# Altium schematic sheet FPGA_2_MICS_SUP.SchDoc: FMC DAC 1.5GS 4CH
size 420 x 297 mm; Author: G.Kasprowicz; CompanyName: WUT ISE; DrawnBy: G.Kasprowicz; Organization: WUT ISE; Address1: PW ISE; Address2: Nowowiejska 15/19 00-665 Warsaw; Address3: gkasprow@gmail.com; Revision: 1; SheetNumber: 23; SheetTotal: 25; ModifiedBy: -; CheckedDate: -; Title2: FMC; DivGrp: WUT ISE; Designer: G.Kasprowicz; ModifiedDate: -; ProjectName: Sensor Box
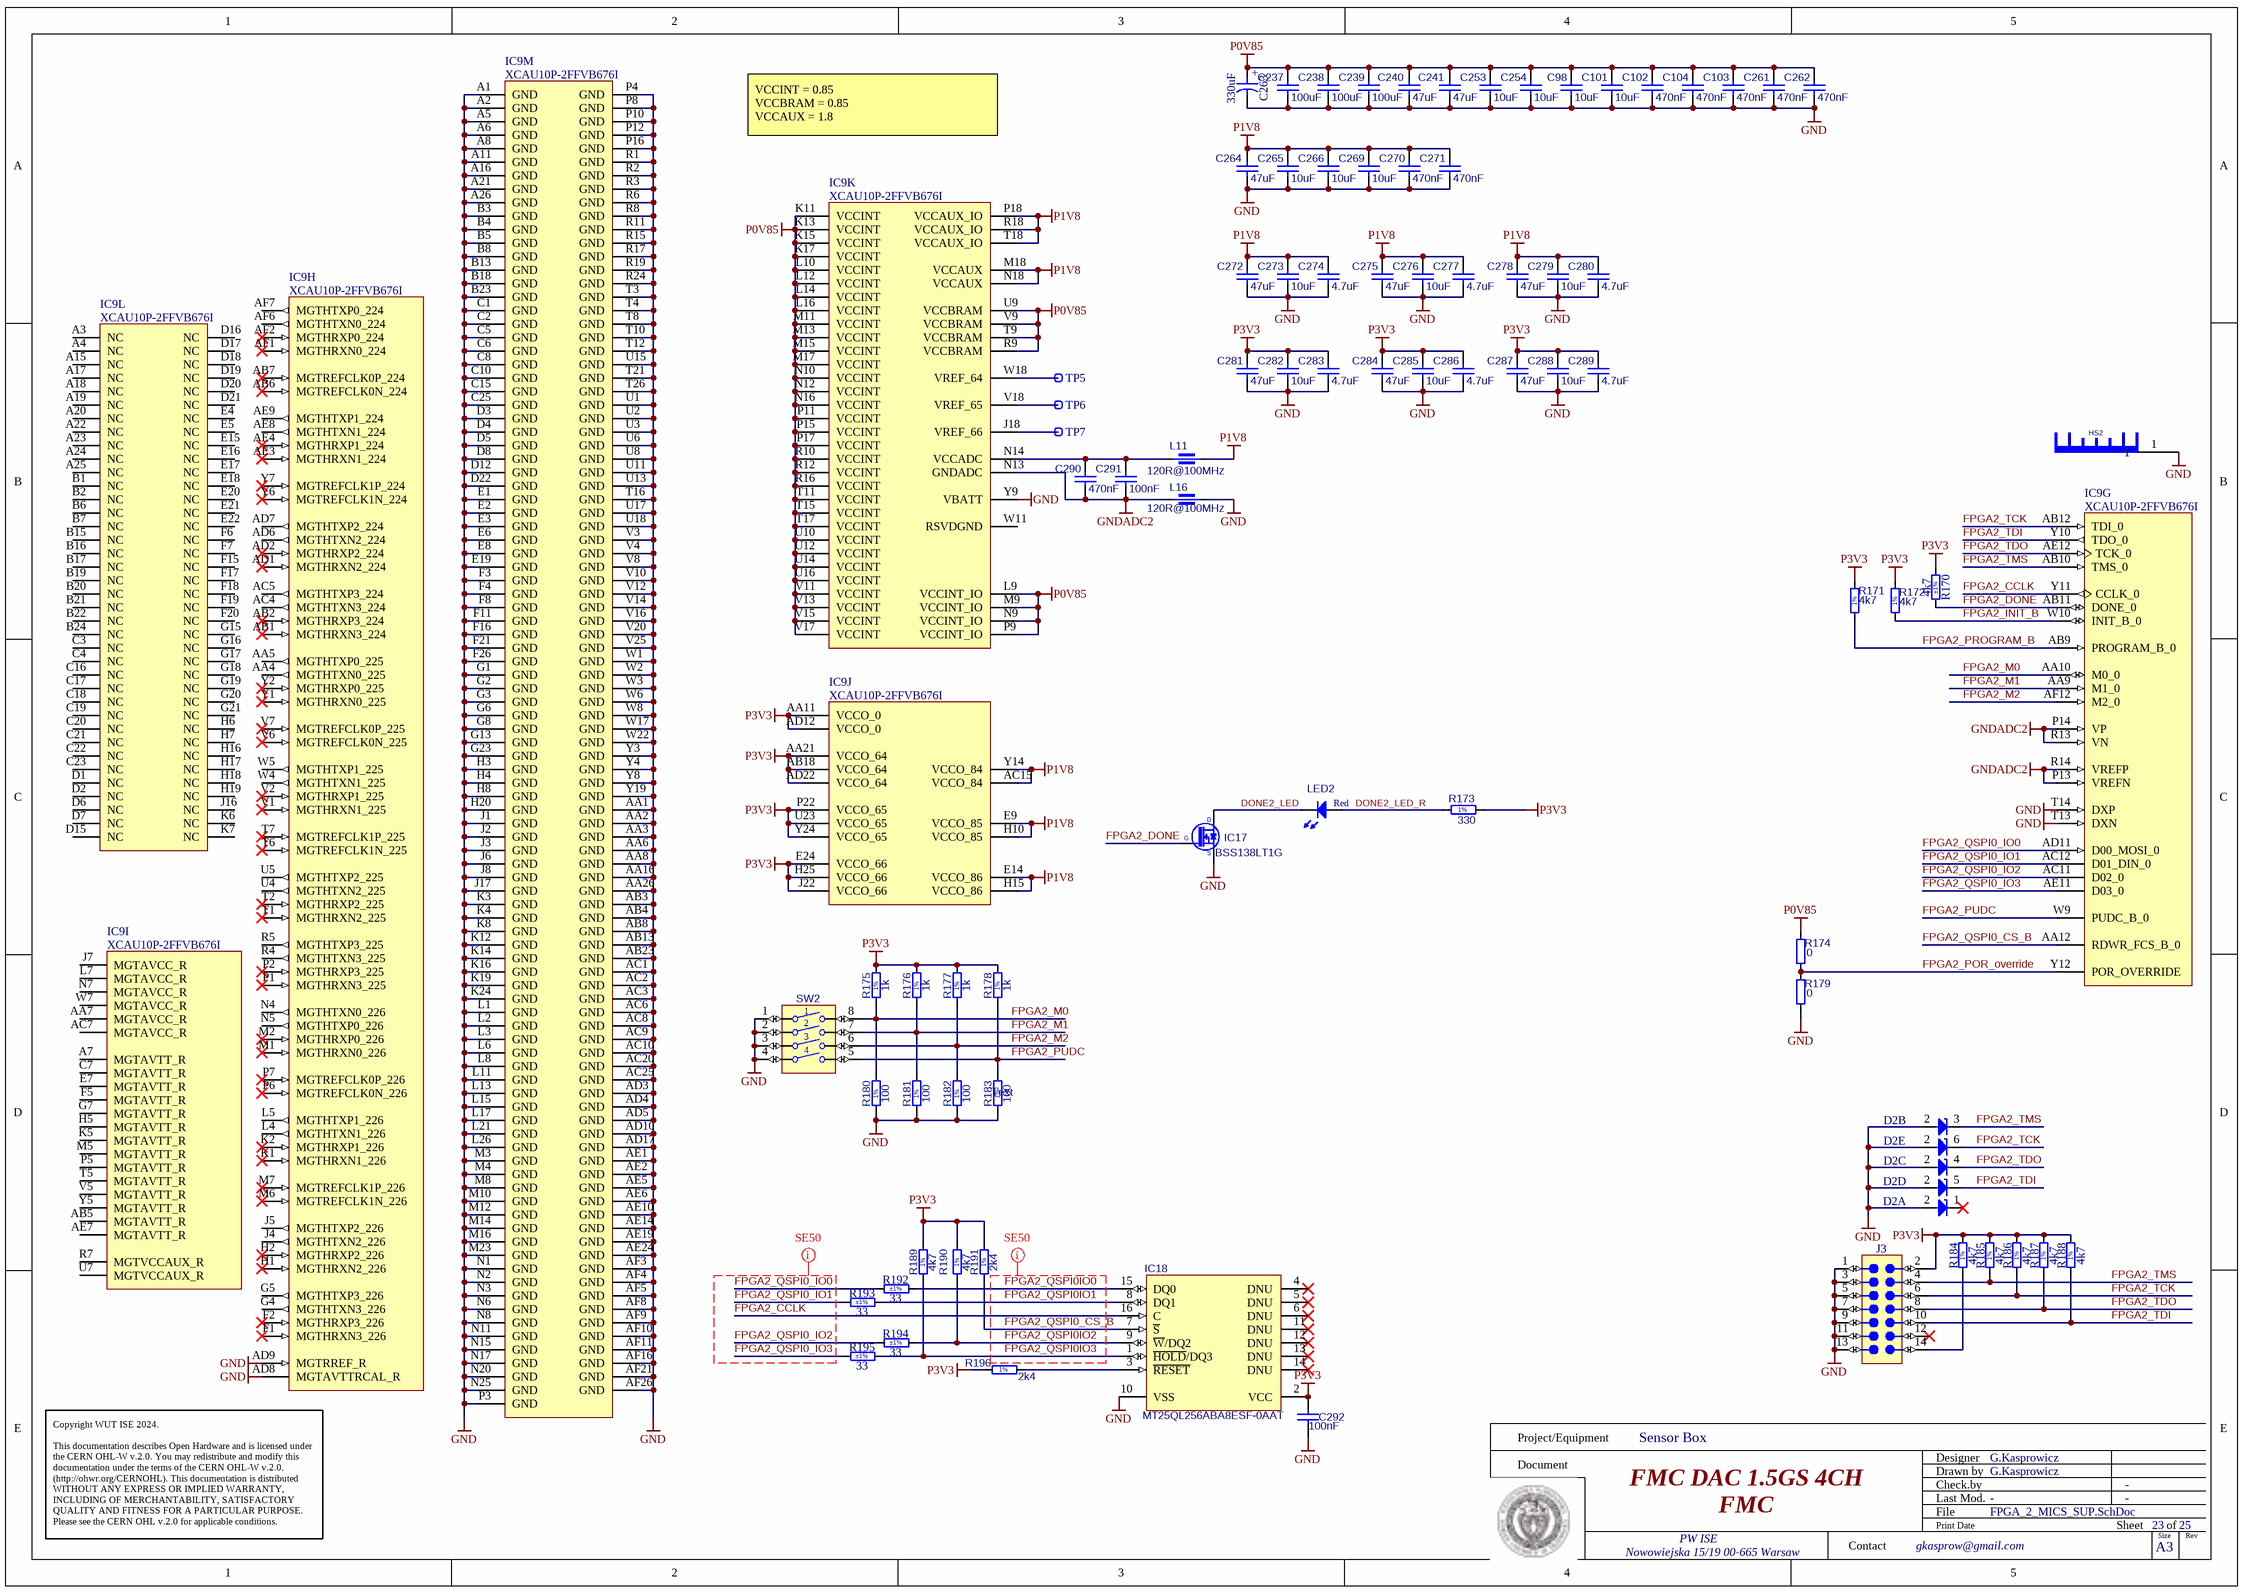
[diagram p0: FPGA_2_MICS_SUP.SchDoc]

## Parts
C98  10uF  [CAPC1005X70N]
C101  10uF  [CAPC1005X70N]
C102  470nF  [CAPC0603X33N]
C103  470nF  [CAPC0603X33N]
C104  470nF  [CAPC0603X33N]
C237  100uF  [CAPC2013X145N]
C238  100uF  [CAPC2013X145N]
C239  100uF  [CAPC2013X145N]
C240  47uF  [CAPC1608X100N]
C241  47uF  [CAPC1608X100N]
C253  10uF  [CAPC1005X70N]
C254  10uF  [CAPC1005X70N]
C261  470nF  [CAPC0603X33N]
C262  470nF  [CAPC0603X33N]
C263  330uF  [CAPMP7343X190N]
C264  47uF  [CAPC1608X100N]
C265  10uF  [CAPC1005X70N]
C266  10uF  [CAPC1005X70N]
C269  10uF  [CAPC1005X70N]
C270  470nF  [CAPC0603X33N]
C271  470nF  [CAPC0603X33N]
C272  47uF  [CAPC1608X100N]
C273  10uF  [CAPC1005X70N]
C274  4.7uF  [CAPC1005X61N]
C275  47uF  [CAPC1608X100N]
C276  10uF  [CAPC1005X70N]
C277  4.7uF  [CAPC1005X61N]
C278  47uF  [CAPC1608X100N]
C279  10uF  [CAPC1005X70N]
C280  4.7uF  [CAPC1005X61N]
C281  47uF  [CAPC1608X100N]
C282  10uF  [CAPC1005X70N]
C283  4.7uF  [CAPC1005X61N]
C284  47uF  [CAPC1608X100N]
C285  10uF  [CAPC1005X70N]
C286  4.7uF  [CAPC1005X61N]
C287  47uF  [CAPC1608X100N]
C288  10uF  [CAPC1005X70N]
C289  4.7uF  [CAPC1005X61N]
C290  470nF  [CAPC1005X55N]
C291  100nF  [CAPC0603X33N]
C292  100nF  [CAPC0603X33N]
D2  PESD3V3L5UY  [SOT65P210X110-6N]  (value not drawn)  (parts A,B,C,D,E of 5)
HS2  Heat Sink No Pad  [HSINK_WAKEFIELD_SKV585811-CU]  (value not drawn)
IC9  XCAU10P-2FFVB676I  [BGA676C100P26X26_2700X2700X350]  (parts G,H,I,J,K,L,M of 13)
IC17  BSS138LT1G  [SOT95P240X110-3N]
IC18  MT25QL256ABA8ESF-0AAT  [SOIC127P1030X265-16N]
J3  (no value)  [MOLEX_87832-1420]
L11  120R@100MHz  [INDC1608X95N]
L16  120R@100MHz  [INDC1608X95N]
LED2  Red  [LED_KINGBRIGHT_KPH-1608SURCK]
R170  4k7  Tolerance: ±1%  [RESC1005X40N]
R171  4k7  [RESC1005X40N]
R172  4k7  [RESC1005X40N]
R173  330  [RESC1005X40N]
R174  0  [RESC1005X40N]
R175  1k  [RESC1005X40N]
R176  1k  [RESC1005X40N]
R177  1k  [RESC1005X40N]
R178  1k  [RESC1005X40N]
R179  0  [RESC1005X40N]
R180  100  [RESC1005X40N]
R181  100  [RESC1005X40N]
R182  100  [RESC1005X40N]
R183  100  [RESC1005X40N]
R184  4k7  [RESC1005X40N]
R185  4k7  [RESC1005X40N]
R186  4k7  [RESC1005X40N]
R187  4k7  [RESC1005X40N]
R188  4k7  [RESC1005X40N]
R189  4k7  [RESC1005X40N]
R190  4k7  [RESC1005X40N]
R191  2k4  [RESC1005X40N]
R192  33  Tolerance: ±1%  [RESC1005X40N]
R193  33  Tolerance: ±1%  [RESC1005X40N]
R194  33  Tolerance: ±1%  [RESC1005X40N]
R195  33  Tolerance: ±1%  [RESC1005X40N]
R196  2k4  [RESC1005X40N]
SW2  Switch  [SW_TYCO_1571983-4]  (value not drawn)
TP5  Test Point  [TPS127]  (value not drawn)
TP6  Test Point  [TPS127]  (value not drawn)
TP7  Test Point  [TPS127]  (value not drawn)

## Nets
GND: C98.1 C101.1 C102.1 C103.1 C104.1 C237.1 C238.1 C239.1 C240.1 C241.1 C253.1 C254.1 C261.1 C262.1 C263.2 C264.1 C265.1 C266.1 C269.1 C270.1 C271.1 C272.1 C273.1 C274.1 C275.1 C276.1 C277.1 C278.1 C279.1 C280.1 C281.1 C282.1 C283.1 C284.1 C285.1 C286.1 C287.1 C288.1 C289.1 C292.1 D2.2(A) HS2.1 IC9.A1(GND) IC9.A2(GND) IC9.A5(GND) IC9.A6(GND) IC9.A8(GND) IC9.A11(GND) IC9.A16(GND) IC9.A21(GND) IC9.A26(GND) IC9.AA1(GND) IC9.AA2(GND) IC9.AA3(GND) IC9.AA6(GND) IC9.AA8(GND) IC9.AA16(GND) IC9.AA26(GND) IC9.AB3(GND) IC9.AB4(GND) IC9.AB8(GND) IC9.AB13(GND) IC9.AB23(GND) IC9.AC1(GND) IC9.AC2(GND) IC9.AC3(GND) IC9.AC6(GND) IC9.AC8(GND) IC9.AC9(GND) IC9.AC10(GND) IC9.AC20(GND) IC9.AC25(GND) IC9.AD3(GND) IC9.AD4(GND) IC9.AD5(GND) IC9.AD8(MGTAVTTRCAL_R) IC9.AD9(MGTRREF_R) IC9.AD10(GND) IC9.AD17(GND) IC9.AE1(GND) IC9.AE2(GND) IC9.AE5(GND) IC9.AE6(GND) IC9.AE10(GND) IC9.AE14(GND) IC9.AE19(GND) IC9.AE24(GND) IC9.AF3(GND) IC9.AF4(GND) IC9.AF5(GND) IC9.AF8(GND) IC9.AF9(GND) IC9.AF10(GND) IC9.AF11(GND) IC9.AF16(GND) IC9.AF21(GND) IC9.AF26(GND) IC9.B3(GND) IC9.B4(GND) IC9.B5(GND) IC9.B8(GND) IC9.B13(GND) IC9.B18(GND) IC9.B23(GND) IC9.C1(GND) IC9.C2(GND) IC9.C5(GND) IC9.C6(GND) IC9.C8(GND) IC9.C10(GND) IC9.C15(GND) IC9.C25(GND) IC9.D3(GND) IC9.D4(GND) IC9.D5(GND) IC9.D8(GND) IC9.D12(GND) IC9.D22(GND) IC9.E1(GND) IC9.E2(GND) IC9.E3(GND) IC9.E6(GND) IC9.E8(GND) IC9.E19(GND) IC9.F3(GND) IC9.F4(GND) IC9.F8(GND) IC9.F11(GND) IC9.F16(GND) IC9.F21(GND) IC9.F26(GND) IC9.G1(GND) IC9.G2(GND) IC9.G3(GND) IC9.G6(GND) IC9.G8(GND) IC9.G13(GND) IC9.G23(GND) IC9.H3(GND) IC9.H4(GND) IC9.H8(GND) IC9.H20(GND) IC9.J1(GND) IC9.J2(GND) IC9.J3(GND) IC9.J6(GND) IC9.J8(GND) IC9.J17(GND) IC9.K3(GND) IC9.K4(GND) IC9.K8(GND) IC9.K12(GND) IC9.K14(GND) IC9.K16(GND) IC9.K19(GND) IC9.K24(GND) IC9.L1(GND) IC9.L2(GND) IC9.L3(GND) IC9.L6(GND) IC9.L8(GND) IC9.L11(GND) IC9.L13(GND) IC9.L15(GND) IC9.L17(GND) IC9.L21(GND) IC9.L26(GND) IC9.M3(GND) IC9.M4(GND) IC9.M8(GND) IC9.M10(GND) IC9.M12(GND) IC9.M14(GND) IC9.M16(GND) IC9.M23(GND) IC9.N1(GND) IC9.N2(GND) IC9.N3(GND) IC9.N6(GND) IC9.N8(GND) IC9.N11(GND) IC9.N15(GND) IC9.N17(GND) IC9.N20(GND) IC9.N25(GND) IC9.P3(GND) IC9.P4(GND) IC9.P8(GND) IC9.P10(GND) IC9.P12(GND) IC9.P16(GND) IC9.R1(GND) IC9.R2(GND) IC9.R3(GND) IC9.R6(GND) IC9.R8(GND) IC9.R11(GND) IC9.R15(GND) IC9.R17(GND) IC9.R19(GND) IC9.R24(GND) IC9.T3(GND) IC9.T4(GND) IC9.T8(GND) IC9.T10(GND) IC9.T12(GND) IC9.T13(DXN) IC9.T14(DXP) IC9.T16(GND) IC9.T21(GND) IC9.T26(GND) IC9.U1(GND) IC9.U2(GND) IC9.U3(GND) IC9.U6(GND) IC9.U8(GND) IC9.U11(GND) IC9.U13(GND) IC9.U15(GND) IC9.U17(GND) IC9.U18(GND) IC9.V3(GND) IC9.V4(GND) IC9.V8(GND) IC9.V10(GND) IC9.V12(GND) IC9.V14(GND) IC9.V16(GND) IC9.V20(GND) IC9.V25(GND) IC9.W1(GND) IC9.W2(GND) IC9.W3(GND) IC9.W6(GND) IC9.W8(GND) IC9.W17(GND) IC9.W22(GND) IC9.Y3(GND) IC9.Y4(GND) IC9.Y8(GND) IC9.Y9(VBATT) IC9.Y19(GND) IC17.2(S) IC18.10(VSS) J3.1 J3.3 J3.5 J3.7 J3.9 J3.11 J3.13 L16.2 R179.1 R180.1 R181.1 R182.1 R183.1 SW2.1 SW2.2 SW2.3 SW2.4
GNDADC2: C290.1 C291.1 IC9.N13(GNDADC) IC9.P13(VREFN) IC9.P14(VP) IC9.R13(VN) IC9.R14(VREFP) L16.1
P0V85: C98.2 C101.2 C102.2 C103.2 C104.2 C237.2 C238.2 C239.2 C240.2 C241.2 C253.2 C254.2 C261.2 C262.2 C263.1 IC9.K11(VCCINT) IC9.K13(VCCINT) IC9.K15(VCCINT) IC9.K17(VCCINT) IC9.L9(VCCINT_IO) IC9.L10(VCCINT) IC9.L12(VCCINT) IC9.L14(VCCINT) IC9.L16(VCCINT) IC9.M9(VCCINT_IO) IC9.M11(VCCINT) IC9.M13(VCCINT) IC9.M15(VCCINT) IC9.M17(VCCINT) IC9.N9(VCCINT_IO) IC9.N10(VCCINT) IC9.N12(VCCINT) IC9.N16(VCCINT) IC9.P9(VCCINT_IO) IC9.P11(VCCINT) IC9.P15(VCCINT) IC9.P17(VCCINT) IC9.R9(VCCBRAM) IC9.R10(VCCINT) IC9.R12(VCCINT) IC9.R16(VCCINT) IC9.T9(VCCBRAM) IC9.T11(VCCINT) IC9.T15(VCCINT) IC9.T17(VCCINT) IC9.U9(VCCBRAM) IC9.U10(VCCINT) IC9.U12(VCCINT) IC9.U14(VCCINT) IC9.U16(VCCINT) IC9.V9(VCCBRAM) IC9.V11(VCCINT) IC9.V13(VCCINT) IC9.V15(VCCINT) IC9.V17(VCCINT) R174.2
P1V8: C264.2 C265.2 C266.2 C269.2 C270.2 C271.2 C272.2 C273.2 C274.2 C275.2 C276.2 C277.2 C278.2 C279.2 C280.2 IC9.AC15(VCCO_84) IC9.E9(VCCO_85) IC9.E14(VCCO_86) IC9.H10(VCCO_85) IC9.H15(VCCO_86) IC9.M18(VCCAUX) IC9.N18(VCCAUX) IC9.P18(VCCAUX_IO) IC9.R18(VCCAUX_IO) IC9.T18(VCCAUX_IO) IC9.Y14(VCCO_84) L11.2
P3V3: C281.2 C282.2 C283.2 C284.2 C285.2 C286.2 C287.2 C288.2 C289.2 C292.2 IC9.AA11(VCCO_0) IC9.AA21(VCCO_64) IC9.AB18(VCCO_64) IC9.AD12(VCCO_0) IC9.AD22(VCCO_64) IC9.E24(VCCO_66) IC9.H25(VCCO_66) IC9.J22(VCCO_66) IC9.P22(VCCO_65) IC9.U23(VCCO_65) IC9.Y24(VCCO_65) IC18.2(VCC) J3.2 R170.2 R171.2 R172.2 R173.2 R175.2 R176.2 R177.2 R178.2 R184.2 R185.2 R186.2 R187.2 R188.2 R189.2 R190.2 R191.2 R196.1
DONE2_LED: IC17.3(D) LED2.1(C)
DONE2_LED_R: LED2.2(A) R173.1
FPGA2_CCLK: IC9.Y11(CCLK_0) IC18.16(C)
FPGA2_DONE: IC9.AB11(DONE_0) IC17.1(G) R170.1
FPGA2_INIT_B: IC9.W10(INIT_B_0) R172.1
FPGA2_M0: IC9.AA10(M0_0) R175.1 R180.2 SW2.8
FPGA2_M1: IC9.AA9(M1_0) R176.1 R181.2 SW2.7
FPGA2_M2: IC9.AF12(M2_0) R177.1 R182.2 SW2.6
FPGA2_POR_override: IC9.Y12(POR_OVERRIDE) R174.1 R179.2
FPGA2_PROGRAM_B: IC9.AB9(PROGRAM_B_0) R171.1
FPGA2_PUDC: IC9.W9(PUDC_B_0) R178.1 R183.2 SW2.5
FPGA2_QSPI0_CS_B: IC9.AA12(RDWR_FCS_B_0) IC18.7(~{S}) R191.1
FPGA2_QSPI0_IO0: IC9.AD11(D00_MOSI_0) R192.1
FPGA2_QSPI0_IO1: IC9.AC12(D01_DIN_0) R193.1
FPGA2_QSPI0_IO2: IC9.AC11(D02_0) R194.1
FPGA2_QSPI0_IO3: IC9.AE11(D03_0) R195.1
FPGA2_QSPI0IO0: IC18.15(DQ0) R192.2
FPGA2_QSPI0IO1: IC18.8(DQ1) R193.2
FPGA2_QSPI0IO2: IC18.9(~{W}/DQ2) R190.1 R194.2
FPGA2_QSPI0IO3: IC18.1(~{HOLD}/DQ3) R189.1 R195.2
FPGA2_TCK: D2.6(C) IC9.AB12(TDI_0) J3.6 R186.1
FPGA2_TDI: D2.5(C) IC9.Y10(TDO_0) J3.10 R188.1
FPGA2_TDO: D2.4(C) IC9.AE12(TCK_0) J3.8 R187.1
FPGA2_TMS: D2.3(C) IC9.AB10(TMS_0) J3.4 R185.1
NetC290_2: C290.2 C291.2 IC9.N14(VCCADC) L11.1
NetIC9_J18: IC9.J18(VREF_66) TP7.1
NetIC9_V18: IC9.V18(VREF_65) TP6.1
NetIC9_W18: IC9.W18(VREF_64) TP5.1
NetIC18_3: IC18.3(~{RESET}) R196.2
NetJ3_14: J3.14 R184.1

Not connected (* = marked no-connect by the designer): D2 1(C)*; IC9 A3(NC) A4(NC) A7(MGTAVTT_R) A15(NC) A17(NC) A18(NC) A19(NC) A20(NC) A22(NC) A23(NC) A24(NC) A25(NC) AA4(MGTHTXN0_225) AA5(MGTHTXP0_225) AA7(MGTAVCC_R) AB1(MGTHRXN3_224)* AB2(MGTHRXP3_224)* AB5(MGTAVTT_R) AB6(MGTREFCLK0N_224)* AB7(MGTREFCLK0P_224)* AC4(MGTHTXN3_224) AC5(MGTHTXP3_224) AC7(MGTAVCC_R) AD1(MGTHRXN2_224)* AD2(MGTHRXP2_224)* AD6(MGTHTXN2_224) AD7(MGTHTXP2_224) AE3(MGTHRXN1_224)* AE4(MGTHRXP1_224)* AE7(MGTAVTT_R) AE8(MGTHTXN1_224) AE9(MGTHTXP1_224) AF1(MGTHRXN0_224)* AF2(MGTHRXP0_224)* AF6(MGTHTXN0_224) AF7(MGTHTXP0_224) B1(NC) B2(NC) B6(NC) B7(NC) B15(NC) B16(NC) B17(NC) B19(NC) B20(NC) B21(NC) B22(NC) B24(NC) C3(NC) C4(NC) C7(MGTAVTT_R) C16(NC) C17(NC) C18(NC) C19(NC) C20(NC) C21(NC) C22(NC) C23(NC) D1(NC) D2(NC) D6(NC) D7(NC) D15(NC) D16(NC) D17(NC) D18(NC) D19(NC) D20(NC) D21(NC) E4(NC) E5(NC) E7(MGTAVTT_R) E15(NC) E16(NC) E17(NC) E18(NC) E20(NC) E21(NC) E22(NC) F1(MGTHRXN3_226)* F2(MGTHRXP3_226)* F5(MGTAVTT_R) F6(NC) F7(NC) F15(NC) F17(NC) F18(NC) F19(NC) F20(NC) G4(MGTHTXN3_226) G5(MGTHTXP3_226) G7(MGTAVTT_R) G15(NC) G16(NC) G17(NC) G18(NC) G19(NC) G20(NC) G21(NC) H1(MGTHRXN2_226)* H2(MGTHRXP2_226)* H5(MGTAVTT_R) H6(NC) H7(NC) H16(NC) H17(NC) H18(NC) H19(NC) J4(MGTHTXN2_226) J5(MGTHTXP2_226) J7(MGTAVCC_R) J16(NC) K1(MGTHRXN1_226)* K2(MGTHRXP1_226)* K5(MGTAVTT_R) K6(NC) K7(NC) L4(MGTHTXN1_226) L5(MGTHTXP1_226) L7(MGTAVCC_R) M1(MGTHRXN0_226)* M2(MGTHRXP0_226)* M5(MGTAVTT_R) M6(MGTREFCLK1N_226)* M7(MGTREFCLK1P_226)* N4(MGTHTXN0_226) N5(MGTHTXP0_226) N7(MGTAVCC_R) P1(MGTHRXN3_225)* P2(MGTHRXP3_225)* P5(MGTAVTT_R) P6(MGTREFCLK0N_226)* P7(MGTREFCLK0P_226)* R4(MGTHTXN3_225) R5(MGTHTXP3_225) R7(MGTVCCAUX_R) T1(MGTHRXN2_225)* T2(MGTHRXP2_225)* T5(MGTAVTT_R) T6(MGTREFCLK1N_225)* T7(MGTREFCLK1P_225)* U4(MGTHTXN2_225) U5(MGTHTXP2_225) U7(MGTVCCAUX_R) V1(MGTHRXN1_225)* V2(MGTHRXP1_225)* V5(MGTAVTT_R) V6(MGTREFCLK0N_225)* V7(MGTREFCLK0P_225)* W4(MGTHTXN1_225) W5(MGTHTXP1_225) W7(MGTAVCC_R) W11(RSVDGND) Y1(MGTHRXN0_225)* Y2(MGTHRXP0_225)* Y5(MGTAVTT_R) Y6(MGTREFCLK1N_224)* Y7(MGTREFCLK1P_224)*; IC18 4(DNU)* 5(DNU)* 6(DNU)* 11(DNU)* 12(DNU)* 13(DNU)* 14(DNU)*; J3 12*

## Layout directives
net class SE50: FPGA2_CCLK, FPGA2_QSPI0_CS_B, FPGA2_QSPI0_IO0, FPGA2_QSPI0_IO1, FPGA2_QSPI0_IO2, FPGA2_QSPI0_IO3, FPGA2_QSPI0IO0, FPGA2_QSPI0IO1, FPGA2_QSPI0IO2, FPGA2_QSPI0IO3

## Notes on the sheet
- VCCINT = 0.85
  VCCBRAM = 0.85
  VCCAUX = 1.8
- (near R183) Text
- Project/Equipment
- Document
- Designer
- Drawn by
- Check.by
- Copyright WUT ISE 2024.
  This documentation describes Open Hardware and is licensed under the CERN OHL-W v.2.0. You may redistribute and modify this documentation under the terms of the CERN OHL-W v.2.0. (http://ohwr.org/CERNOHL). This documentation is distributed WITHOUT ANY EXPRESS OR IMPLIED WARRANTY, INCLUDING OF MERCHANTABILITY, SATISFACTORY QUALITY AND FITNESS FOR A PARTICULAR PURPOSE. Please see the CERN OHL v.2.0 for applicable conditions.
- Contact
- File
- Last Mod.
- Print Date
- Sheet
- Size
- A3
- of
- Rev
- (in symbol CTE7343-19_330UF_2.5V_20%_LESR0009_KEMET_T520) +
- (in symbol R0402_1k_1%_0.0625W_100PPM) 1%
- (in symbol R0402_2K4_1%_0.0625W_100PPM) 1%
- (in symbol R0402_4K7_1%_0.0625W_100PPM) 1%
- (in symbol R0402_4k7_1%_0.0625W_100PPM) 1%
- (in symbol R0402_100R_1%_0.0625W_100PPM) 1%
- (in symbol R0402_330R_1%_0.0625W_100PPM) 1%

## Library data of the parts
C98 C101 C253 C254 C265 C266 C269 C273 C276 C279 C282 C285 C288 = CC0402_10UF_6.3V_20%_X5R: Non-polarised capacitor; Part Description: SMD Multilayer Chip Ceramic Capacitor; Manufacturer: GENERIC; Manufacturer1 Part Number: C1005X5R0J106M050BC; Voltage: 6.3V; TC: X5R; Tolerance: ±10%; Part Number: CC0402_10UF_6.3V_20%_X5R; Component Kind: Standard; Component Type: Standard; Pin Count: 2; Value: 10uF; Status: Preferred; Manufacturer Part Number: CC0402_10UF_6.3V_20%_X5R; Case: 0402; Mounted: Yes; Socket: No; SMD: Yes; Sense: No; Manufacturer1 Example: TDK; Manufacturer1 ComponentHeight: 0.70mm; HelpURL: \\cern.ch\dfs\Applications\Altium\Datasheets\CC0402_X5R_TDK_C.pdf; Author: CERN DEM JLC; CreateDate: 07.01.2015; LatestRevisionDate: 07.01.2015
C102-C104 C261 C262 C270 C271 = CC0201_470NF_4V_20%_X5R: Non-polarised capacitor; Part Description: SMD Multilayer Chip Ceramic Capacitor; Manufacturer: GENERIC; Manufacturer1 Part Number: AMK063BJ474MP-F; Voltage: 4V; TC: X5R; Tolerance: ±20%; Part Number: CC0201_470NF_4V_20%_X5R; Component Kind: Standard; Component Type: Standard; Pin Count: 2; Value: 470nF; Status: Not Recommended; Manufacturer Part Number: CC0201_470NF_4V_20%_X5R; Case: 0201; Mounted: Yes; Socket: No; SMD: Yes; Sense: No; Manufacturer1 Example: TAIYO YUDEN; Manufacturer1 ComponentHeight: 0.33mm; HelpURL: \\cern.ch\dfs\Applications\Altium\Datasheets\CC0201_X5R_TAIYO-YUDEN_STANDARD-CLASS2.pdf; Author: CERN DEM JLC; CreateDate: 27.05.2010; LatestRevisionDate: 27.05.2010
C237-C239 = CC0805_100UF_4V_20%_X6S_MURATA_GRM21BC80G107ME15: Non-polarised capacitor; Part Description: Chip Multilayer Ceramic Capacitor for General Purpose; Manufacturer: MURATA; Voltage: 4V; TC: X6S; Tolerance: ±20%; Part Number: CC0805_100UF_4V_20%_X6S_MURATA_GRM21BC80G107ME15; Component Kind: Standard; Component Type: Standard; Pin Count: 2; Value: 100uF; Status: None; Manufacturer Part Number: GRM21BC80G107ME15; Case: 0805; Mounted: Yes; Socket: No; SMD: Yes; Sense: No; ComponentHeight: 1.45mm; HelpURL: \\cern.ch\dfs\Applications\Altium\Datasheets\CC0805_MURATA_GRM21BC80G107ME15.pdf; Author: CERN DEM BC; CreateDate: 2020-09-02; LatestRevisionDate: 2020-09-02
C240 C241 C264 = CC0603_47UF_2.5V_20%_X6S_MURATA_GRM188C80E476ME05: Non-polarised capacitor; Part Description: Chip Multilayer Ceramic Capacitor for General Purpose; Manufacturer: MURATA; Voltage: 2.5V; TC: X6S; Tolerance: ±20%; Part Number: CC0603_47UF_2.5V_20%_X6S_MURATA_GRM188C80E476ME05; Component Kind: Standard; Component Type: Standard; Pin Count: 2; Value: 47uF; Status: None; Manufacturer Part Number: GRM188C80E476ME05; Case: 0603; Mounted: Yes; Socket: No; SMD: Yes; Sense: No; ComponentHeight: 1mm; HelpURL: \\cern.ch\dfs\Applications\Altium\Datasheets\CC0603_MURATA_GRM188C80E476ME05.pdf; Author: CERN DEM BC; CreateDate: 2020-09-02; LatestRevisionDate: 2020-09-02
C263 = CTE7343-19_330UF_2.5V_20%_LESR0009_KEMET_T520: Polarised capacitor; Part Description: Low ESR 0R009 Tantalum Chip Capacitor; Manufacturer: KEMET; Manufacturer Part Number: T520V337M2R5ATE009; Voltage: 2.5V; Tolerance: ±20%; Part Number: CTE7343-19_330UF_2.5V_20%_LESR0009_KEMET_T520; Component Kind: Standard; Component Type: Standard; Pin Count: 2; Value: 330uF; Status: None; Case: V; Mounted: Yes; Socket: No; SMD: Yes; Sense: No; ComponentHeight: 1.9mm; HelpURL: \\cern.ch\dfs\Applications\Altium\Datasheets\CTE-LESR_KEMET_T520.pdf; Author: CERN DEM HF; CreateDate: 30.05.2024; LatestRevisionDate: 30.05.2024
C272 C275 C278 C281 C284 C287 = CC0603_47UF_6.3V_20%_X5R: Non-polarised capacitor; Part Description: SMD Multilayer Chip Ceramic Capacitor; Manufacturer: GENERIC; Manufacturer1 Part Number: GRM188R60J476ME15D; Voltage: 6.3V; TC: X5R; Tolerance: ±20%; Part Number: CC0603_47UF_6.3V_20%_X5R; Component Kind: Standard; Component Type: Standard; Pin Count: 2; Value: 47uF; Status: None; Manufacturer Part Number: CC0603_47UF_6.3V_20%_X5R; Case: 0603; Mounted: Yes; Socket: No; SMD: Yes; Sense: No; Manufacturer1 Example: MURATA; Manufacturer1 ComponentHeight: 1mm; HelpURL: \\cern.ch\dfs\Applications\Altium\Datasheets\CC0603_MURATA_GRM188R60J476ME15D.pdf; Author: CERN DEM JLC; CreateDate: 2018-02-01; LatestRevisionDate: 2018-02-01
C274 C277 C280 C283 C286 C289 = CC0402_4.7UF_4V_20%_X6S_TDK_C1005X6S0G475M050BC: Non-polarised capacitor; Part Description: SMD Multilayer Chip Ceramic Capacitor (Commercial Grade); Manufacturer: TDK; Voltage: 4V; TC: X6S; Tolerance: ±20%; Part Number: CC0402_4.7UF_4V_20%_X6S_TDK_C1005X6S0G475M050BC; Component Kind: Standard; Component Type: Standard; Pin Count: 2; Value: 4.7uF; Status: None; Manufacturer Part Number: C1005X6S0G475M050BC; Case: 0402; Mounted: Yes; Socket: No; SMD: Yes; Sense: No; ComponentHeight: 0.65mm; HelpURL: \\cern.ch\dfs\Applications\Altium\Datasheets\CC0402_X6S_TDK_C(up to 75V).pdf; Author: CERN DEM BC; CreateDate: 2020-09-14; LatestRevisionDate: 2020-09-14
C290 = CC0402_470NF_16V_10%_X5R: Non-polarised capacitor; Part Description: SMD Multilayer Chip Ceramic Capacitor; Manufacturer: GENERIC; Manufacturer1 Part Number: C1005X5R1C105KT; Voltage: 16V; TC: X5R; Tolerance: ±10%; Part Number: CC0402_470NF_16V_10%_X5R; Component Kind: Standard; Component Type: Standard; Pin Count: 2; Value: 470nF; Status: Preferred; Manufacturer Part Number: CC0402_470NF_16V_10%_X5R; Case: 0402; Mounted: Yes; Socket: No; SMD: Yes; Sense: No; Manufacturer1 Example: TDK; Manufacturer1 ComponentHeight: 0.55mm; HelpURL: \\cern.ch\dfs\Applications\Altium\Datasheets\CC0402_X5R_TDK_C.pdf; Author: CERN DEM JLC; CreateDate: 2012-10-25; LatestRevisionDate: 2012-10-25
C291 C292 = CC0201_100NF_6.3V_10%_X5R: Non-polarised capacitor; Manufacturer: GENERIC; Part Description: SMD Multilayer Chip Ceramic Capacitor; Manufacturer1 Part Number: 02016D104KAT2A; Tolerance: ±10%; Voltage: 6.3V; TC: X5R; Manufacturer Part Number: CC0201_100NF_6.3V_10%_X5R; Part Number: CC0201_100NF_6.3V_10%_X5R; Value: 100nF; Component Kind: Standard; Component Type: Standard; Pin Count: 2; Status: Not Recommended; Case: 0201; Mounted: Yes; Socket: No; SMD: Yes; Sense: No; Manufacturer1 Example: AVX; Manufacturer1 ComponentHeight: 0.33mm; HelpURL: \\cern.ch\dfs\Applications\Altium\Datasheets\CC0201_X5R_AVX.pdf; Author: CERN DEM JLC; CreateDate: 03.12.2007; LatestRevisionDate: 03.12.2007
D2 = PESD3V3L5UY: Fivefold ESD Protection Diode Arrays; Part Description: Fivefold ESD Protection Diode Arrays (30kV); Manufacturer: NEXPERIA; Voltage: 3.3V; Power: 200W; PressFit: No; Bonding: No; Part Number: PESD3V3L5UY; Component Kind: Standard; Component Type: Standard; Device: PESD3V3L5UY; PackageDescription: SOT363, SC-88, 0.65mm Pitch; 6 Pin, 1.25mm W X 2.00mm L X 1.10mm H body, IPC Medium Density; Manufacturer Part Number: PESD3V3L5UY; Pin Count: 6; Case: SOT363; Mounted: Yes; Socket: No; SMD: Yes; Sense: No; ComponentHeight: 1.1mm; HelpURL: \\cern.ch\dfs\Applications\Altium\Datasheets\PESD3V3L5UY.pdf; Author: CERN DEM WB; CreateDate: 05/07/2021; LatestRevisionDate: 05/07/2021
HS2 = HSINK_WAKEFIELD_SKV585811-CU: Heat Sink Without Pad; Part Description: Copper Skived Fin Heat Sink, Rth: 7.70°C/W, with Plastic Push Pin Attachement; Manufacturer: WAKEFIELD-VETTE; PressFit: No; Part Number: HSINK_WAKEFIELD_SKV585811-CU; Component Kind: Accessories; Component Type: Standard; Pin Count: 0; PackageDescription: Copper Skived Fin Heat Sink; Body 58mm x 58mm Height 11mm; Mounted: Yes; Socket: No; SMD: No; Sense: No; Status: None; Manufacturer Part Number: SKV585811-CU; ComponentHeight: 11mm; HelpURL: \\cern.ch\dfs\Applications\Altium\Datasheets\HSINK_WAKEFIELD_SKV585811.pdf; Author: CERN DEM JMW; CreateDate: 2019-11-26; LatestRevisionDate: 2019-11-26
IC9 = XCAU10P-2FFVB676I: Artix UltraScale + Field Programmable Gate Array (FPGA), 676-Pin BGA, Industrial Grade; Manufacturer: AMD; PressFit: No; Bonding: No; Part Number: XCAU10P-2FFVB676I; Component Kind: Standard; Component Type: Standard; Device: XCAU10P-2FFVB676I; PackageDescription: BGA, 1.00mm Pitch, Square; 672 Pin, 26 Columns X 26 Rows, Body 27.00mm X 27.00mm X 3.50mm H, IPC Medium Density; Part Description: Artix UltraScale + Field Programmable Gate Array (FPGA), 676-Pin BGA, Industrial Grade; Manufacturer Part Number: XCAU10P-2FFVB676I; Pin Count: 676; Case: BGA676; Mounted: Yes; Socket: No; SMD: Yes; Sense: No; ComponentHeight: 3.50mm; HelpURL: \\cern.ch\dfs\Applications\Altium\Datasheets\XCAU10P-2FFVB676I.pdf; ComponentLink1URL: \\cern.ch\dfs\Applications\Altium\Datasheets\XCAU10P-2FFVB676I_Package.pdf; ComponentLink1Description: Package Drawing; ComponentLink2URL: \\cern.ch\dfs\Applications\Altium\Datasheets\XCAU10P-2FFVB676I_Pinout.pdf; ComponentLink2Description: Pinout; Author: CERN DEM HF; CreateDate: 10.02.2025; LatestRevisionDate: 10.02.2025
IC17 = BSS138LT1G: N-CHANNEL MOSFET WITH DIODE; Part Description: 50V 200mA N-Channel Enhancement Mode Field-Effect Transistor; Manufacturer: ON SEMICONDUCTOR; PressFit: No; Bonding: No; Part Number: BSS138LT1G; Component Kind: Standard; Component Type: Standard; Device: BSS138LT1G; PackageDescription: SOT23 3-Leads, Pitch 0.95mm - Body 1.4x3mm, IPC Medium Density; Manufacturer Part Number: BSS138LT1G; Pin Count: 3; Case: SOT23-3; Mounted: Yes; Socket: No; SMD: Yes; Sense: No; ComponentHeight: 1.11mm; HelpURL: \\cern.ch\dfs\Applications\Altium\Datasheets\BSS138LT1G.pdf; Author: CERN DEM JLC; CreateDate: 23.03.2009; LatestRevisionDate: 23.03.2009
IC18 = MT25QL256ABA8ESF-0AAT: 256Mbit (32MB), 2.7V-3.6V, Multiple I/O Serial NOR Flash Memory,with Reset# & Hold#; Part Description: 256Mbit (32MB), 2.7V-3.6V, Multiple I/O Serial NOR Flash Memory,with Reset# & Hold# (Automotive grade AEC-Q100); Manufacturer: MICRON TECHNOLOGY; PressFit: No; Bonding: No; Part Number: MT25QL256ABA8ESF-0AAT; Component Kind: Standard; Component Type: Standard; Device: MT25QL256ABA8ESF-0AAT; PackageDescription: SOIC, 1.27mm Pitch; 16 Pin, 7.50mm W X 10.3mm L X 2.65mm H body, IPC Medium Density; Manufacturer Part Number: MT25QL256ABA8ESF-0AAT; Pin Count: 16; Case: SOIC16; Mounted: Yes; Socket: No; SMD: Yes; Sense: No; ComponentHeight: 2.65mm; HelpURL: \\cern.ch\dfs\Applications\Altium\Datasheets\MT25QL256ABA8ESF-0AAT.pdf; Author: CERN DEM JLC; CreateDate: 2018-11-05; LatestRevisionDate: 2018-11-05
J3 = MOLEX_87832-1420: Connector 14 Male; Part Description: 2.00mm (.079") Pitch Milli-Grid™ Header, Surface Mount, Vertical, Shrouded, 14 Circuits, with Locking Windows and Centre Polarization Slot, PCB Locator; Manufacturer: MOLEX; PressFit: No; Part Number: MOLEX_87832-1420; Component Kind: Standard; Component Type: Standard; Pin Count: 14; Family: Milli-Grid™; Mounted: Yes; Socket: No; SMD: Yes; Manufacturer Part Number: 87832-1420; ComponentHeight: 7.6mm; HelpURL: \\cern.ch\dfs\Applications\Altium\Datasheets\MOLEX_87832-1420.pdf; Author: CERN DEM JLC; CreateDate: 09/09/2008; LatestRevisionDate: 09/09/2008; Table: MOLEX; Status: None; Supplier: Radiospares; SupplierRef: 6701071; Sense: No
L11 L16 = IND0603_MURATA_BLM18PG121SN1D: Part Description: SMD EMIFIL Chip Ferrite Bead; Manufacturer: MURATA; Power: 2A; Resistance: 0.05R; Part Number: IND0603_MURATA_BLM18PG121SN1D; Component Kind: Standard; Component Type: Standard; Pin Count: 2; Value: 120R@100MHz; Status: None; Manufacturer Part Number: BLM18PG121SN1D; Case: 0603; Mounted: Yes; Socket: No; SMD: Yes; Sense: No; ComponentHeight: 0.95mm; HelpURL: \\cern.ch\dfs\Applications\Altium\Datasheets\IND0603_MURATA_BLM18P.pdf; Author: CERN DEM BC; CreateDate: 27.07.2015; LatestRevisionDate: 25.10.2018
LED2 = LED_KINGBRIGHT_KPH-1608SURCK: LED Red 1C 2A; Part Description: SMD Hyper Red LED, Case 1.6mmX0.8mm(0603), 0.65mm Thickness; PressFit: No; Bonding: No; Part Number: LED_KINGBRIGHT_KPH-1608SURCK; Component Kind: Standard; Component Type: Standard; Color: Red; PackageDescription: SMT Hyper Red LED, Case 0603, Body L 1.6 x W 0.8mm H 0.65mm; Manufacturer: KINGBRIGHT; Manufacturer Part Number: KPH-1608SURCK; Pin Count: 2; Mounted: Yes; Socket: No; SMD: Yes; Sense: No; ComponentHeight: 0.65mm; HelpURL: \\cern.ch\dfs\Applications\Altium\Datasheets\LED_KINGBRIGHT_KPH-1608SURCK.pdf; Author: CERN DEM JLC; CreateDate: 03.07.2017; LatestRevisionDate: 03.07.2017
R170 R184-R188 = R0402_4K7_1%_0.0625W_100PPM: Resistor - 1%; Part Description: General Purpose Thick Film Chip Resistor; Manufacturer: GENERIC; Manufacturer1 Part Number: 232270674702L; TC: ±100ppm/°C; PressFit: No; Part Number: R0402_4K7_1%_0.0625W_100PPM; Component Kind: Standard; Component Type: Standard; Pin Count: 2; Value: 4k7; Status: Not Recommended; Power: 0.0625W; Manufacturer Part Number: R0402_4K7_1%_0.0625W_100PPM; Case: 0402; Mounted: Yes; Sense: No; Socket: No; SMD: Yes; Manufacturer1 Example: YAGEO PHYCOMP; Manufacturer1 ComponentHeight: 0.4mm; HelpURL: \\cern.ch\dfs\Applications\Altium\Datasheets\R0402_Phycomp_RC0402.pdf; Author: CERN DEM JLC
  R170: CreateDate: 03.12.2007; LatestRevisionDate: 17.10.2012
  R184-R188: Tolerance: ±1%; CreateDate: 03/12/2007; LatestRevisionDate: 17/10/2012
R171 R172 = R0402_4k7_1%_0.0625W_100PPM: Resistor - 1%; Manufacturer: GENERIC; Part Description: General Purpose Thick Film Chip Resistor; Manufacturer1 Part Number: 232270674702L; TC: ±100ppm/°C; PressFit: No; Manufacturer Part Number: R0402_4K7_1%_0.0625W_100PPM; Part Number: R0402_4K7_1%_0.0625W_100PPM; Tolerance: ±1%; Value: 4k7; Component Kind: Standard; Component Type: Standard; Pin Count: 2; Status: Not Recommended; Power: 0.0625W; Case: 0402; Mounted: Yes; Sense: No; Socket: No; SMD: Yes; Manufacturer1 Example: YAGEO PHYCOMP; Manufacturer1 ComponentHeight: 0.4mm; HelpURL: \\cern.ch\dfs\Applications\Altium\Datasheets\R0402_Phycomp_RC0402.pdf; Author: CERN DEM JLC; CreateDate: 2007-12-03; LatestRevisionDate: 2012-10-17
R173 = R0402_330R_1%_0.0625W_100PPM: Resistor - 1%; Part Description: General Purpose Thick Film Chip Resistor; Manufacturer: GENERIC; Manufacturer1 Part Number: 232270673301L; TC: ±100ppm/°C; Table: Resistors SMD; Part Number: R0402_330R_1%_0.0625W_100PPM; Component Kind: Standard; Component Type: Standard; Pin Count: 2; Value: 330; Status: Not recommended; Power: 0.0625W; Tolerance: ±1%; Manufacturer Part Number: R0402_330R_1%_0.0625W_100PPM; Case: 0402; Mounted: Yes; Socket: No; SMD: Yes; Manufacturer1 Example: YAGEO PHYCOMP; Manufacturer1 ComponentHeight: 0.4mm; HelpURL: \\cern.ch\dfs\Applications\Altium\Datasheets\R0402_Phycomp_RC0402.pdf; Author: CERN DEM JLC; CreateDate: 2007-12-03; LatestRevisionDate: 2012-10-17
R174 R179 = R0402_0R_JUMPER: Resistor; Manufacturer: GENERIC; Part Description: 1A (0.05R Max DC Resistance) Zero Ohm Jumper; Manufacturer1 Part Number: 232270591001L; PressFit: No; Manufacturer Part Number: R0402_0R_JUMPER; Part Number: R0402_0R_JUMPER; Value: 0; Component Kind: Standard; Component Type: Standard; Pin Count: 2; Status: Not Recommended; Case: 0402; Mounted: Yes; Sense: No; Socket: No; SMD: Yes; Manufacturer1 Example: YAGEO PHYCOMP; Manufacturer1 ComponentHeight: 0.4mm; HelpURL: \\cern.ch\dfs\Applications\Altium\Datasheets\R0402_Phycomp_RC0402.pdf; Author: CERN DEM JLC; CreateDate: 2007-12-03; LatestRevisionDate: 2012-10-17
R175-R178 = R0402_1k_1%_0.0625W_100PPM: Resistor - 1%; Part Description: General Purpose Thick Film Chip Resistor; Manufacturer: GENERIC; Manufacturer1 Part Number: 232270671002L; TC: ±100ppm/°C; PressFit: No; Part Number: R0402_1K_1%_0.0625W_100PPM; Component Kind: Standard; Component Type: Standard; Pin Count: 2; Value: 1k; Status: Not Recommended; Power: 0.0625W; Tolerance: ±1%; Manufacturer Part Number: R0402_1K_1%_0.0625W_100PPM; Case: 0402; Mounted: Yes; Sense: No; Socket: No; SMD: Yes; Manufacturer1 Example: YAGEO PHYCOMP; Manufacturer1 ComponentHeight: 0.4mm; HelpURL: \\cern.ch\dfs\Applications\Altium\Datasheets\R0402_Phycomp_RC0402.pdf; Author: CERN DEM JLC; CreateDate: 2007-12-03; LatestRevisionDate: 2012-10-17
R180-R183 = R0402_100R_1%_0.0625W_100PPM: Resistor - 1%; Part Description: General Purpose Thick Film Chip Resistor; Manufacturer: GENERIC; Manufacturer1 Part Number: 232270671001L; TC: ±100ppm/°C; PressFit: No; Part Number: R0402_100R_1%_0.0625W_100PPM; Component Kind: Standard; Component Type: Standard; Pin Count: 2; Value: 100; Status: Not Recommended; Power: 0.0625W; Tolerance: ±1%; Manufacturer Part Number: R0402_100R_1%_0.0625W_100PPM; Case: 0402; Mounted: Yes; Sense: No; Socket: No; SMD: Yes; Manufacturer1 Example: YAGEO PHYCOMP; Manufacturer1 ComponentHeight: 0.4mm; HelpURL: \\cern.ch\dfs\Applications\Altium\Datasheets\R0402_Phycomp_RC0402.pdf; Author: CERN DEM JLC; CreateDate: 03-Dec-07; LatestRevisionDate: 17-Oct-12
R189 R190 = R0402_4K7_1%_0.0625W_100PPM: Resistor - 1%; Manufacturer: GENERIC; Part Description: General Purpose Thick Film Chip Resistor; Manufacturer1 Part Number: 232270674702L; TC: ±100ppm/°C; PressFit: No; Manufacturer Part Number: R0402_4K7_1%_0.0625W_100PPM; Part Number: R0402_4K7_1%_0.0625W_100PPM; Tolerance: ±1%; Value: 4k7; Component Kind: Standard; Component Type: Standard; Pin Count: 2; Status: Not Recommended; Power: 0.0625W; Case: 0402; Mounted: Yes; Sense: No; Socket: No; SMD: Yes; Manufacturer1 Example: YAGEO PHYCOMP; Manufacturer1 ComponentHeight: 0.4mm; HelpURL: \\cern.ch\dfs\Applications\Altium\Datasheets\R0402_Phycomp_RC0402.pdf; Author: CERN DEM JLC; CreateDate: 03.12.2007; LatestRevisionDate: 17.10.2012
R191 R196 = R0402_2K4_1%_0.0625W_100PPM: Resistor - 1%; Manufacturer: GENERIC; Part Description: General Purpose Thick Film Chip Resistor; Manufacturer1 Part Number: 232270672402L; TC: ±100ppm/°C; PressFit: No; Manufacturer Part Number: R0402_2K4_1%_0.0625W_100PPM; Part Number: R0402_2K4_1%_0.0625W_100PPM; Tolerance: ±1%; Value: 2k4; Component Kind: Standard; Component Type: Standard; Pin Count: 2; Status: Not Recommended; Power: 0.0625W; Case: 0402; Mounted: Yes; Sense: No; Socket: No; SMD: Yes; Manufacturer1 Example: YAGEO PHYCOMP; Manufacturer1 ComponentHeight: 0.4mm; HelpURL: \\cern.ch\dfs\Applications\Altium\Datasheets\R0402_Phycomp_RC0402.pdf; Author: CERN DEM JLC; CreateDate: 03.12.2007; LatestRevisionDate: 17.10.2012
R192-R195 = R0402_33R_1%_0.0625W_100PPM: Resistor - 1%; Part Description: General Purpose Thick Film Chip Resistor; Manufacturer: GENERIC; Manufacturer1 Part Number: 232270673309L; TC: ±100ppm/°C; PressFit: No; Part Number: R0402_33R_1%_0.0625W_100PPM; Component Kind: Standard; Component Type: Standard; Pin Count: 2; Value: 33; Status: Not Recommended; Power: 0.0625W; Manufacturer Part Number: R0402_33R_1%_0.0625W_100PPM; Case: 0402; Mounted: Yes; Sense: No; Socket: No; SMD: Yes; Manufacturer1 Example: YAGEO PHYCOMP; Manufacturer1 ComponentHeight: 0.4mm; HelpURL: \\cern.ch\dfs\Applications\Altium\Datasheets\R0402_Phycomp_RC0402.pdf; Author: CERN DEM JLC; CreateDate: 03.12.2007; LatestRevisionDate: 17.10.2012
SW2 = SW_TYCO_1571983-4: 4 Ways SPST DIP Switch; Part Description: 4 Way SPST SMD DIP Switch, Latched, Contact Rating 0.025A 24VDC; Manufacturer: TYCO; Manufacturer Part Number: 1571983-4 or GDH04S04; PressFit: No; Part Number: SW_TYCO_1571983-4; Component Kind: Standard; Component Type: Standard; Pin Count: 8; PackageDescription: Pitch 1.27mm,  Body 6.2x6.2mm, 4 Ways SPST Surface-Mount DIP Switch, TYCO GDH Series; Family: Switch; Mounted: Yes; Socket: No; SMD: Yes; Sense: No; Status: None; ComponentHeight: 2.31mm; HelpURL: \\cern.ch\dfs\Applications\Altium\Datasheets\SW_TYCO_1571983-4.pdf; Author: CERN DEM JLC; CreateDate: 08-Jan-09; LatestRevisionDate: 08-Jan-09
TP5-TP7 = SMD_PAD_1.27X1.27MM: Part Description: 1.27mm x 1.27mm PCB Copper Area (SMD Test Point); Mounted: No; Part Number: SMD_PAD_1.27X1.27MM; Component Kind: Standard (No BOM); Component Type: Standard (No BOM); Pin Count: 1; Family: Test Point; Socket: No; SMD: Yes; Sense: No; Status: None; ComponentHeight: 0mm; HelpURL: Undefined; Author: CERN DEM JLC; CreateDate: 12.01.2008; LatestRevisionDate: 12.01.2008; PackageDescription: 1.27mm x 1.27mm PCB Copper Area (SMD Test Point)